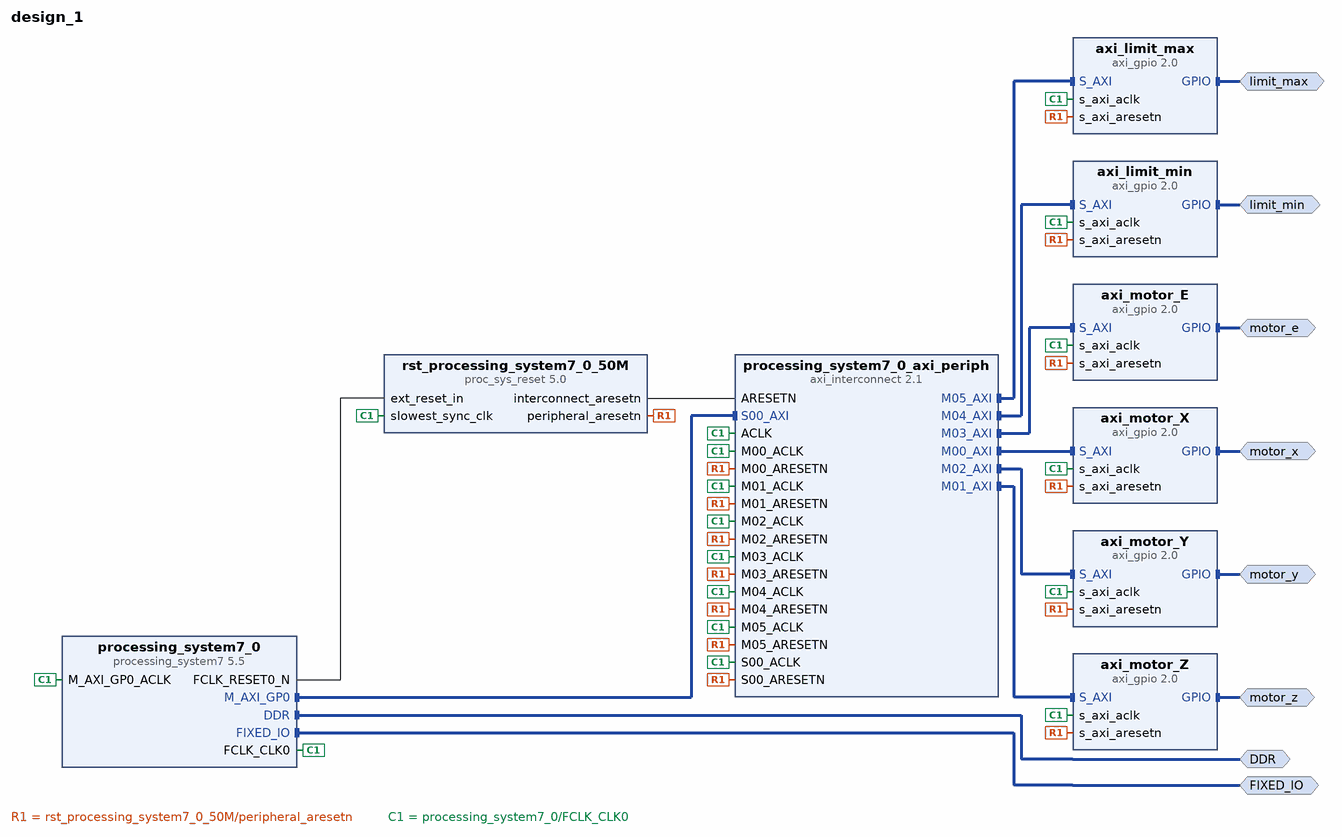
[diagram p0: block diagram of the top level]
# Vivado block design design_1, xc7z020clg400-1, Vivado 2018.1
create_bd_design design_1

create_bd_intf_port -mode Master -vlnv xilinx.com:interface:ddrx_rtl:1.0 DDR
create_bd_intf_port -mode Master -vlnv xilinx.com:display_processing_system7:fixedio_rtl:1.0 FIXED_IO
create_bd_intf_port -mode Master -vlnv xilinx.com:interface:gpio_rtl:1.0 motor_x
create_bd_intf_port -mode Master -vlnv xilinx.com:interface:gpio_rtl:1.0 motor_z
create_bd_intf_port -mode Master -vlnv xilinx.com:interface:gpio_rtl:1.0 motor_y
create_bd_intf_port -mode Master -vlnv xilinx.com:interface:gpio_rtl:1.0 motor_e
create_bd_intf_port -mode Master -vlnv xilinx.com:interface:gpio_rtl:1.0 limit_min
create_bd_intf_port -mode Master -vlnv xilinx.com:interface:gpio_rtl:1.0 limit_max

create_bd_cell -type ip -vlnv xilinx.com:ip:axi_gpio:2.0 axi_motor_X
set_property -dict {CONFIG.C_GPIO_WIDTH 3 CONFIG.C_ALL_OUTPUTS 1} [get_bd_cells axi_motor_X]
create_bd_cell -type ip -vlnv xilinx.com:ip:axi_gpio:2.0 axi_motor_Z
set_property -dict {CONFIG.C_GPIO_WIDTH 3 CONFIG.C_ALL_OUTPUTS 1} [get_bd_cells axi_motor_Z]
create_bd_cell -type ip -vlnv xilinx.com:ip:axi_gpio:2.0 axi_motor_Y
set_property -dict {CONFIG.C_GPIO_WIDTH 3 CONFIG.C_ALL_OUTPUTS 1} [get_bd_cells axi_motor_Y]
create_bd_cell -type ip -vlnv xilinx.com:ip:axi_gpio:2.0 axi_limit_max
set_property -dict {CONFIG.C_GPIO_WIDTH 3 CONFIG.C_ALL_OUTPUTS 1} [get_bd_cells axi_limit_max]
create_bd_cell -type ip -vlnv xilinx.com:ip:axi_gpio:2.0 axi_motor_E
set_property -dict {CONFIG.C_GPIO_WIDTH 3 CONFIG.C_ALL_OUTPUTS 1} [get_bd_cells axi_motor_E]
create_bd_cell -type ip -vlnv xilinx.com:ip:axi_gpio:2.0 axi_limit_min
set_property -dict {CONFIG.C_GPIO_WIDTH 3 CONFIG.C_ALL_OUTPUTS 1} [get_bd_cells axi_limit_min]
create_bd_cell -type ip -vlnv xilinx.com:ip:processing_system7:5.5 processing_system7_0
set_property -dict [list \
  CONFIG.PCW_UIPARAM_DDR_FREQ_MHZ 533.333333 \
  CONFIG.PCW_APU_PERIPHERAL_FREQMHZ 666.666666 \
  CONFIG.PCW_UART_PERIPHERAL_FREQMHZ 100 \
  CONFIG.PCW_FPGA0_PERIPHERAL_FREQMHZ 50 \
  CONFIG.PCW_FPGA1_PERIPHERAL_FREQMHZ 50 \
  CONFIG.PCW_USE_FABRIC_INTERRUPT 1 \
  CONFIG.PCW_IRQ_F2P_INTR 1 \
  CONFIG.PCW_GP0_EN_MODIFIABLE_TXN 0 \
  CONFIG.PCW_GP1_EN_MODIFIABLE_TXN 0 \
  CONFIG.PCW_PERIPHERAL_BOARD_PRESET None \
  CONFIG.PCW_PRESET_BANK1_VOLTAGE {LVCMOS 3.3V} \
  CONFIG.PCW_UIPARAM_DDR_PARTNO {MT41K256M16 RE-125} \
  CONFIG.PCW_QSPI_PERIPHERAL_ENABLE 0 \
  CONFIG.PCW_ENET0_PERIPHERAL_ENABLE 0 \
  CONFIG.PCW_SD0_PERIPHERAL_ENABLE 0 \
  CONFIG.PCW_UART1_PERIPHERAL_ENABLE 1 \
  CONFIG.PCW_UART1_UART1_IO {MIO 48 .. 49} \
  CONFIG.PCW_USB0_PERIPHERAL_ENABLE 0 \
  CONFIG.PCW_GPIO_MIO_GPIO_ENABLE 0 \
] [get_bd_cells processing_system7_0]
# 342 more settings of processing_system7_0 are not shown: defaults, MIO pin electricals, DDR timing, and values the tool derives
create_bd_cell -type ip -vlnv xilinx.com:ip:axi_interconnect:2.1 processing_system7_0_axi_periph
set_property -dict {CONFIG.NUM_MI 6 CONFIG.SYNCHRONIZATION_STAGES 2} [get_bd_cells processing_system7_0_axi_periph]
create_bd_cell -type ip -vlnv xilinx.com:ip:proc_sys_reset:5.0 rst_processing_system7_0_50M

# ---- connections ----

connect_bd_intf_net [get_bd_intf_pins processing_system7_0/M_AXI_GP0] [get_bd_intf_pins processing_system7_0_axi_periph/S00_AXI]
connect_bd_intf_net [get_bd_intf_pins processing_system7_0_axi_periph/M00_AXI] [get_bd_intf_pins axi_motor_X/S_AXI]
connect_bd_intf_net [get_bd_intf_pins processing_system7_0_axi_periph/M01_AXI] [get_bd_intf_pins axi_motor_Z/S_AXI]
connect_bd_intf_net [get_bd_intf_pins processing_system7_0_axi_periph/M02_AXI] [get_bd_intf_pins axi_motor_Y/S_AXI]
connect_bd_intf_net [get_bd_intf_pins processing_system7_0_axi_periph/M03_AXI] [get_bd_intf_pins axi_motor_E/S_AXI]
connect_bd_intf_net [get_bd_intf_pins processing_system7_0_axi_periph/M04_AXI] [get_bd_intf_pins axi_limit_min/S_AXI]
connect_bd_intf_net [get_bd_intf_pins processing_system7_0_axi_periph/M05_AXI] [get_bd_intf_pins axi_limit_max/S_AXI]
connect_bd_intf_net [get_bd_intf_ports DDR] [get_bd_intf_pins processing_system7_0/DDR]
connect_bd_intf_net [get_bd_intf_ports FIXED_IO] [get_bd_intf_pins processing_system7_0/FIXED_IO]
connect_bd_intf_net [get_bd_intf_ports motor_x] [get_bd_intf_pins axi_motor_X/GPIO]
connect_bd_intf_net [get_bd_intf_ports motor_z] [get_bd_intf_pins axi_motor_Z/GPIO]
connect_bd_intf_net [get_bd_intf_ports motor_y] [get_bd_intf_pins axi_motor_Y/GPIO]
connect_bd_intf_net [get_bd_intf_ports motor_e] [get_bd_intf_pins axi_motor_E/GPIO]
connect_bd_intf_net [get_bd_intf_ports limit_min] [get_bd_intf_pins axi_limit_min/GPIO]
connect_bd_intf_net [get_bd_intf_ports limit_max] [get_bd_intf_pins axi_limit_max/GPIO]
connect_bd_net [get_bd_pins processing_system7_0/FCLK_RESET0_N] [get_bd_pins rst_processing_system7_0_50M/ext_reset_in]
connect_bd_net [get_bd_pins rst_processing_system7_0_50M/peripheral_aresetn] \
  [get_bd_pins axi_motor_X/s_axi_aresetn] [get_bd_pins axi_motor_Z/s_axi_aresetn] [get_bd_pins axi_motor_Y/s_axi_aresetn] \
  [get_bd_pins axi_limit_max/s_axi_aresetn] [get_bd_pins axi_motor_E/s_axi_aresetn] [get_bd_pins axi_limit_min/s_axi_aresetn] \
  [get_bd_pins processing_system7_0_axi_periph/S00_ARESETN] [get_bd_pins processing_system7_0_axi_periph/M00_ARESETN] \
  [get_bd_pins processing_system7_0_axi_periph/M01_ARESETN] [get_bd_pins processing_system7_0_axi_periph/M02_ARESETN] \
  [get_bd_pins processing_system7_0_axi_periph/M03_ARESETN] [get_bd_pins processing_system7_0_axi_periph/M04_ARESETN] \
  [get_bd_pins processing_system7_0_axi_periph/M05_ARESETN]
connect_bd_net [get_bd_pins rst_processing_system7_0_50M/interconnect_aresetn] [get_bd_pins processing_system7_0_axi_periph/ARESETN]
connect_bd_net [get_bd_pins processing_system7_0/FCLK_CLK0] \
  [get_bd_pins axi_motor_X/s_axi_aclk] [get_bd_pins axi_motor_Z/s_axi_aclk] [get_bd_pins axi_motor_Y/s_axi_aclk] \
  [get_bd_pins axi_limit_max/s_axi_aclk] [get_bd_pins axi_motor_E/s_axi_aclk] [get_bd_pins axi_limit_min/s_axi_aclk] \
  [get_bd_pins processing_system7_0/M_AXI_GP0_ACLK] [get_bd_pins processing_system7_0_axi_periph/ACLK] \
  [get_bd_pins processing_system7_0_axi_periph/S00_ACLK] [get_bd_pins processing_system7_0_axi_periph/M00_ACLK] \
  [get_bd_pins processing_system7_0_axi_periph/M01_ACLK] [get_bd_pins processing_system7_0_axi_periph/M02_ACLK] \
  [get_bd_pins processing_system7_0_axi_periph/M03_ACLK] [get_bd_pins processing_system7_0_axi_periph/M04_ACLK] \
  [get_bd_pins processing_system7_0_axi_periph/M05_ACLK] [get_bd_pins rst_processing_system7_0_50M/slowest_sync_clk]

# ---- address map ----
assign_bd_address -offset 0x41200000 -range 64K -target_address_space [get_bd_addr_spaces processing_system7_0/Data] [get_bd_addr_segs axi_motor_X/S_AXI/Reg]
assign_bd_address -offset 0x41210000 -range 64K -target_address_space [get_bd_addr_spaces processing_system7_0/Data] [get_bd_addr_segs axi_motor_Z/S_AXI/Reg]
assign_bd_address -offset 0x41220000 -range 64K -target_address_space [get_bd_addr_spaces processing_system7_0/Data] [get_bd_addr_segs axi_motor_Y/S_AXI/Reg]
assign_bd_address -offset 0x41230000 -range 64K -target_address_space [get_bd_addr_spaces processing_system7_0/Data] [get_bd_addr_segs axi_motor_E/S_AXI/Reg]
assign_bd_address -offset 0x41240000 -range 64K -target_address_space [get_bd_addr_spaces processing_system7_0/Data] [get_bd_addr_segs axi_limit_min/S_AXI/Reg]
assign_bd_address -offset 0x41250000 -range 64K -target_address_space [get_bd_addr_spaces processing_system7_0/Data] [get_bd_addr_segs axi_limit_max/S_AXI/Reg]

validate_bd_design
save_bd_design
